# Altium schematic sheet Main_Sheet.SchDoc
size 431 x 279 mm; SheetNumber: 1; SheetTotal: 4
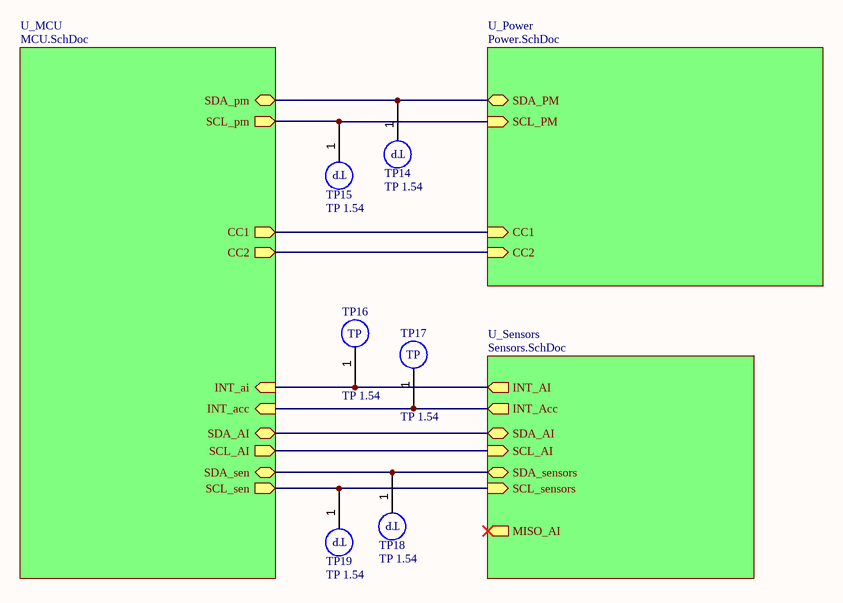
[diagram p0: Main_Sheet.SchDoc]

## Parts
TP14  TP 1.54  [TP-Footprint-1]  (no BOM)
TP15  TP 1.54  [TP-Footprint-1]  (no BOM)
TP16  TP 1.54  [TP-Footprint-1]  (no BOM)
TP17  TP 1.54  [TP-Footprint-1]  (no BOM)
TP18  TP 1.54  [TP-Footprint-1]  (no BOM)
TP19  TP 1.54  [TP-Footprint-1]  (no BOM)

## Sub-sheets
U_MCU = MCU.SchDoc: SDA_sen (bidir), SCL_sen (out), SDA_pm (bidir), INT_acc (in), INT_ai (in), CC2 (out), CC1 (out), SCL_pm (out), SCL_AI (out), SDA_AI (bidir)
U_Power = Power.SchDoc: SDA_PM (bidir), CC1 (in), CC2 (in), SCL_PM (in)
U_Sensors = Sensors.SchDoc: MISO_AI (out), SDA_sensors (bidir), SCL_sensors (in), INT_AI (out), INT_Acc (out), SDA_AI (bidir), SCL_AI (in)

## Nets
NetTP14_1: TP14.1 ; sheet U_Power/SDA_PM, sheet U_MCU/SDA_pm
NetTP15_1: TP15.1 ; sheet U_Power/SCL_PM, sheet U_MCU/SCL_pm
NetTP16_1: TP16.1 ; sheet U_Sensors/INT_AI, sheet U_MCU/INT_ai
NetTP17_1: TP17.1 ; sheet U_Sensors/INT_Acc, sheet U_MCU/INT_acc
NetTP18_1: TP18.1 ; sheet U_Sensors/SDA_sensors, sheet U_MCU/SDA_sen
NetTP19_1: TP19.1 ; sheet U_Sensors/SCL_sensors, sheet U_MCU/SCL_sen
(unnamed): sheet U_Power/CC1, sheet U_MCU/CC1
(unnamed): sheet U_Power/CC2, sheet U_MCU/CC2
(unnamed): sheet U_Sensors/SDA_AI, sheet U_MCU/SDA_AI
(unnamed): sheet U_Sensors/SCL_AI, sheet U_MCU/SCL_AI

## Notes on the sheet
- DWG. NO.
- REV.
- SHT.
- THIS DOCUMENT AND THE DATA DISCLOSED HEREIN OR HEREWITH IS THE PROPERTY OF ALTIUM LIMITED AND MAY BE FREELY DISTRIBUTED IN WHOLE. NO RIGHTS ARE RESERVED OR EXPRESS OR IMPLIED WARANTEE GIVEN.
- REVISION
- DESCRIPTION
- DATE
- APPROVED
- ENG:
- APPROVALS
- PROJECT
- DSN:
- CHK:
- REFERENCE DOCUMENTS
- PROJECT REVISION:
- TITLE
- DOCUMENT REVISION:
- DESIGN ITEM:
- BOM:
- FAB DWG:
- PCB DWG:
- ASSY DWG:
- SCALE:
- SIZE
- B
- CAGE CODE
- FILE NAME
- DWG NO.
- SHEET
- OF
- REV
- (in symbol TestPoint-1) TP

## Library data of the parts
TP14-TP19 = TestPoint-1: Rounded rectangular pad 1.54mm